# Altium schematic sheet Sheet5.SchDoc
size A4; SheetNumber: 1; SheetTotal: 1
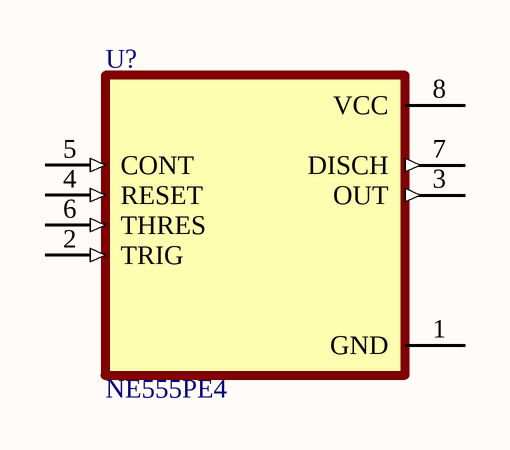
[diagram p0: Sheet5.SchDoc]

## Parts
U?  NE555PE4  [DIP794W45P254L959H508Q8]

## Nets

Not connected (* = marked no-connect by the designer): U? 1(GND) 2(TRIG) 3(OUT) 4(RESET) 5(CONT) 6(THRES) 7(DISCH) 8(VCC)

## Library data of the parts
U? = NE555PE4: MF: {'manufacturer': u'Texas Instruments'}; Availability: Unavailable; Value: *; Package: None; MP: NE555PE4; Price: None